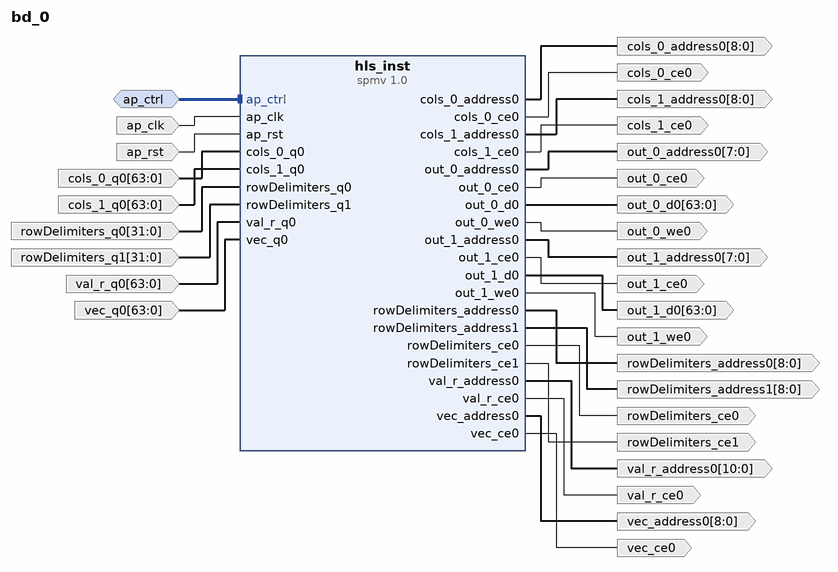
[diagram p0: block diagram of the top level]
# Vivado block design bd_0, xc7vx485tffg1761-2, Vivado 2022.2.2
create_bd_design bd_0

create_bd_intf_port -mode Slave -vlnv xilinx.com:interface:acc_handshake_rtl:1.0 ap_ctrl
create_bd_port -dir I -type clk ap_clk
set_property -dict {CONFIG.FREQ_HZ 100000000.0} [get_bd_ports ap_clk]
create_bd_port -dir I -type rst ap_rst
set_property -dict {CONFIG.POLARITY ACTIVE_HIGH} [get_bd_ports ap_rst]
create_bd_port -dir O -from 8 -to 0 -type data cols_0_address0
create_bd_port -dir O cols_0_ce0
create_bd_port -dir I -from 63 -to 0 -type data cols_0_q0
create_bd_port -dir O -from 8 -to 0 -type data cols_1_address0
create_bd_port -dir O cols_1_ce0
create_bd_port -dir I -from 63 -to 0 -type data cols_1_q0
create_bd_port -dir O -from 7 -to 0 -type data out_0_address0
create_bd_port -dir O out_0_ce0
create_bd_port -dir O -from 63 -to 0 -type data out_0_d0
create_bd_port -dir O out_0_we0
create_bd_port -dir O -from 7 -to 0 -type data out_1_address0
create_bd_port -dir O out_1_ce0
create_bd_port -dir O -from 63 -to 0 -type data out_1_d0
create_bd_port -dir O out_1_we0
create_bd_port -dir O -from 8 -to 0 -type data rowDelimiters_address0
create_bd_port -dir O -from 8 -to 0 -type data rowDelimiters_address1
create_bd_port -dir O rowDelimiters_ce0
create_bd_port -dir O rowDelimiters_ce1
create_bd_port -dir I -from 31 -to 0 -type data rowDelimiters_q0
create_bd_port -dir I -from 31 -to 0 -type data rowDelimiters_q1
create_bd_port -dir O -from 10 -to 0 -type data val_r_address0
create_bd_port -dir O val_r_ce0
create_bd_port -dir I -from 63 -to 0 -type data val_r_q0
create_bd_port -dir O -from 8 -to 0 -type data vec_address0
create_bd_port -dir O vec_ce0
create_bd_port -dir I -from 63 -to 0 -type data vec_q0

create_bd_cell -type ip -vlnv xilinx.com:hls:spmv:1.0 hls_inst

# ---- connections ----

connect_bd_intf_net -intf_net ap_ctrl_0_1 [get_bd_intf_ports ap_ctrl] [get_bd_intf_pins hls_inst/ap_ctrl]
connect_bd_net -net ap_clk_0_1 [get_bd_ports ap_clk] [get_bd_pins hls_inst/ap_clk]
connect_bd_net -net ap_rst_0_1 [get_bd_ports ap_rst] [get_bd_pins hls_inst/ap_rst]
connect_bd_net -net cols_0_q0_0_1 [get_bd_ports cols_0_q0] [get_bd_pins hls_inst/cols_0_q0]
connect_bd_net -net cols_1_q0_0_1 [get_bd_ports cols_1_q0] [get_bd_pins hls_inst/cols_1_q0]
connect_bd_net [get_bd_pins hls_inst/cols_0_address0] [get_bd_ports cols_0_address0]
connect_bd_net [get_bd_pins hls_inst/cols_0_ce0] [get_bd_ports cols_0_ce0]
connect_bd_net [get_bd_pins hls_inst/cols_1_address0] [get_bd_ports cols_1_address0]
connect_bd_net [get_bd_pins hls_inst/cols_1_ce0] [get_bd_ports cols_1_ce0]
connect_bd_net [get_bd_pins hls_inst/out_0_address0] [get_bd_ports out_0_address0]
connect_bd_net [get_bd_pins hls_inst/out_0_ce0] [get_bd_ports out_0_ce0]
connect_bd_net [get_bd_pins hls_inst/out_0_d0] [get_bd_ports out_0_d0]
connect_bd_net [get_bd_pins hls_inst/out_0_we0] [get_bd_ports out_0_we0]
connect_bd_net [get_bd_pins hls_inst/out_1_address0] [get_bd_ports out_1_address0]
connect_bd_net [get_bd_pins hls_inst/out_1_ce0] [get_bd_ports out_1_ce0]
connect_bd_net [get_bd_pins hls_inst/out_1_d0] [get_bd_ports out_1_d0]
connect_bd_net [get_bd_pins hls_inst/out_1_we0] [get_bd_ports out_1_we0]
connect_bd_net [get_bd_pins hls_inst/rowDelimiters_address0] [get_bd_ports rowDelimiters_address0]
connect_bd_net [get_bd_pins hls_inst/rowDelimiters_address1] [get_bd_ports rowDelimiters_address1]
connect_bd_net [get_bd_pins hls_inst/rowDelimiters_ce0] [get_bd_ports rowDelimiters_ce0]
connect_bd_net [get_bd_pins hls_inst/rowDelimiters_ce1] [get_bd_ports rowDelimiters_ce1]
connect_bd_net [get_bd_pins hls_inst/val_r_address0] [get_bd_ports val_r_address0]
connect_bd_net [get_bd_pins hls_inst/val_r_ce0] [get_bd_ports val_r_ce0]
connect_bd_net [get_bd_pins hls_inst/vec_address0] [get_bd_ports vec_address0]
connect_bd_net [get_bd_pins hls_inst/vec_ce0] [get_bd_ports vec_ce0]
connect_bd_net -net rowDelimiters_q0_0_1 [get_bd_ports rowDelimiters_q0] [get_bd_pins hls_inst/rowDelimiters_q0]
connect_bd_net -net rowDelimiters_q1_0_1 [get_bd_ports rowDelimiters_q1] [get_bd_pins hls_inst/rowDelimiters_q1]
connect_bd_net -net val_r_q0_0_1 [get_bd_ports val_r_q0] [get_bd_pins hls_inst/val_r_q0]
connect_bd_net -net vec_q0_0_1 [get_bd_ports vec_q0] [get_bd_pins hls_inst/vec_q0]

validate_bd_design
save_bd_design
